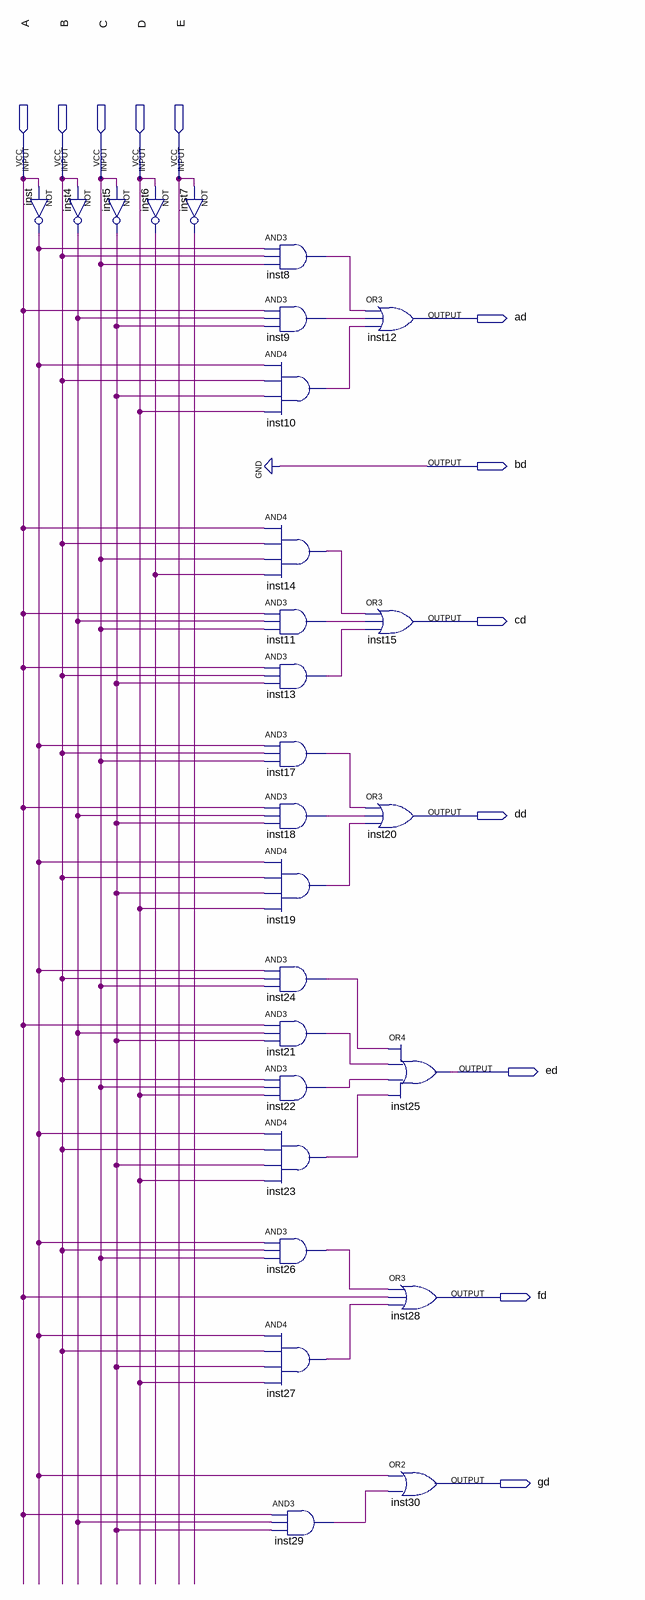
[diagram p0: schematic sheet]
// Quartus schematic DisplayDezena.bdf as structural Verilog: 27 symbols, 12 pins
module DisplayDezena (
  input  A,
  input  B,
  input  C,
  input  D,
  input  E,
  output ad,
  output bd,
  output cd,
  output dd,
  output ed,
  output fd,
  output gd
);

  wire inst4_out, inst5_out, inst6_out, inst7_out, inst8_out, inst9_out, inst10_out, inst11_out, inst13_out,
       inst14_out, inst17_out, inst18_out, inst19_out, inst21_out, inst22_out, inst23_out, inst24_out,
       inst26_out, inst27_out, inst29_out, inst_out;

  not inst (inst_out, A);
  not inst4 (inst4_out, B);
  not inst5 (inst5_out, C);
  not inst6 (inst6_out, D);
  not inst7 (inst7_out, E);
  and inst8 (inst8_out, inst_out, B, C);
  and inst9 (inst9_out, A, inst4_out, inst5_out);
  and inst10 (inst10_out, inst_out, B, inst5_out, D);
  and inst14 (inst14_out, A, B, C, inst6_out);
  and inst11 (inst11_out, A, inst4_out, C);
  and inst13 (inst13_out, A, B, inst5_out);
  and inst17 (inst17_out, inst_out, B, C);
  and inst18 (inst18_out, A, inst4_out, inst5_out);
  and inst19 (inst19_out, inst_out, B, inst5_out, D);
  and inst24 (inst24_out, inst_out, B, C);
  and inst21 (inst21_out, A, inst4_out, inst5_out);
  and inst22 (inst22_out, B, C, D);
  and inst23 (inst23_out, inst_out, B, inst5_out, D);
  and inst26 (inst26_out, inst_out, B, C);
  and inst27 (inst27_out, inst_out, B, inst5_out, D);
  and inst29 (inst29_out, A, inst4_out, inst5_out);
  or inst12 (ad, inst8_out, inst9_out, inst10_out);
  or inst15 (cd, inst14_out, inst11_out, inst13_out);
  or inst20 (dd, inst17_out, inst18_out, inst19_out);
  or inst25 (ed, inst24_out, inst21_out, inst22_out, inst23_out);
  or inst28 (fd, inst26_out, A, inst27_out);
  or inst30 (gd, inst_out, inst29_out);

  assign bd = 1'b0;
endmodule
